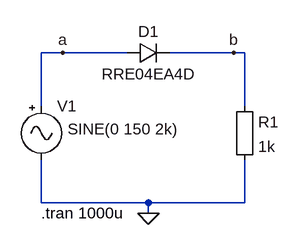
[diagram p0: schematic RP-7.asc]
RP-7.asc, the LTspice schematic file:
Version 4
SHEET 1 880 680
WIRE -176 96 -208 96
WIRE -80 96 -176 96
WIRE 80 96 -16 96
WIRE 96 96 80 96
WIRE -208 176 -208 96
WIRE 96 176 96 96
WIRE -208 320 -208 256
WIRE -48 320 -208 320
WIRE 96 320 96 256
WIRE 96 320 -48 320
WIRE -48 336 -48 320
FLAG -48 336 0
FLAG -176 96 a
FLAG 80 96 b
SYMBOL diode -80 112 R270
WINDOW 0 32 32 VTop 2
WINDOW 3 0 32 VBottom 2
SYMATTR InstName D1
SYMATTR Value RRE04EA4D
SYMBOL Misc\\EuropeanResistor 80 160 R0
SYMATTR InstName R1
SYMATTR Value 1k
SYMBOL Misc\\signal -208 160 R0
WINDOW 123 0 0 Left 2
WINDOW 39 0 0 Left 2
WINDOW 3 39 50 Left 2
SYMATTR Value SINE(0 150 2k)
SYMATTR InstName V1
TEXT -208 336 Left 2 !.tran 1000u

The netlist it stands for:
* RP-7.asc
D1 a b RRE04EA4D
R1 b 0 1k
V1 a 0 SINE(0 150 2k)
.model D D
.lib standard.dio
.tran 1000u
.backanno
.end